# Altium project 平衡车主板.PrjPcb
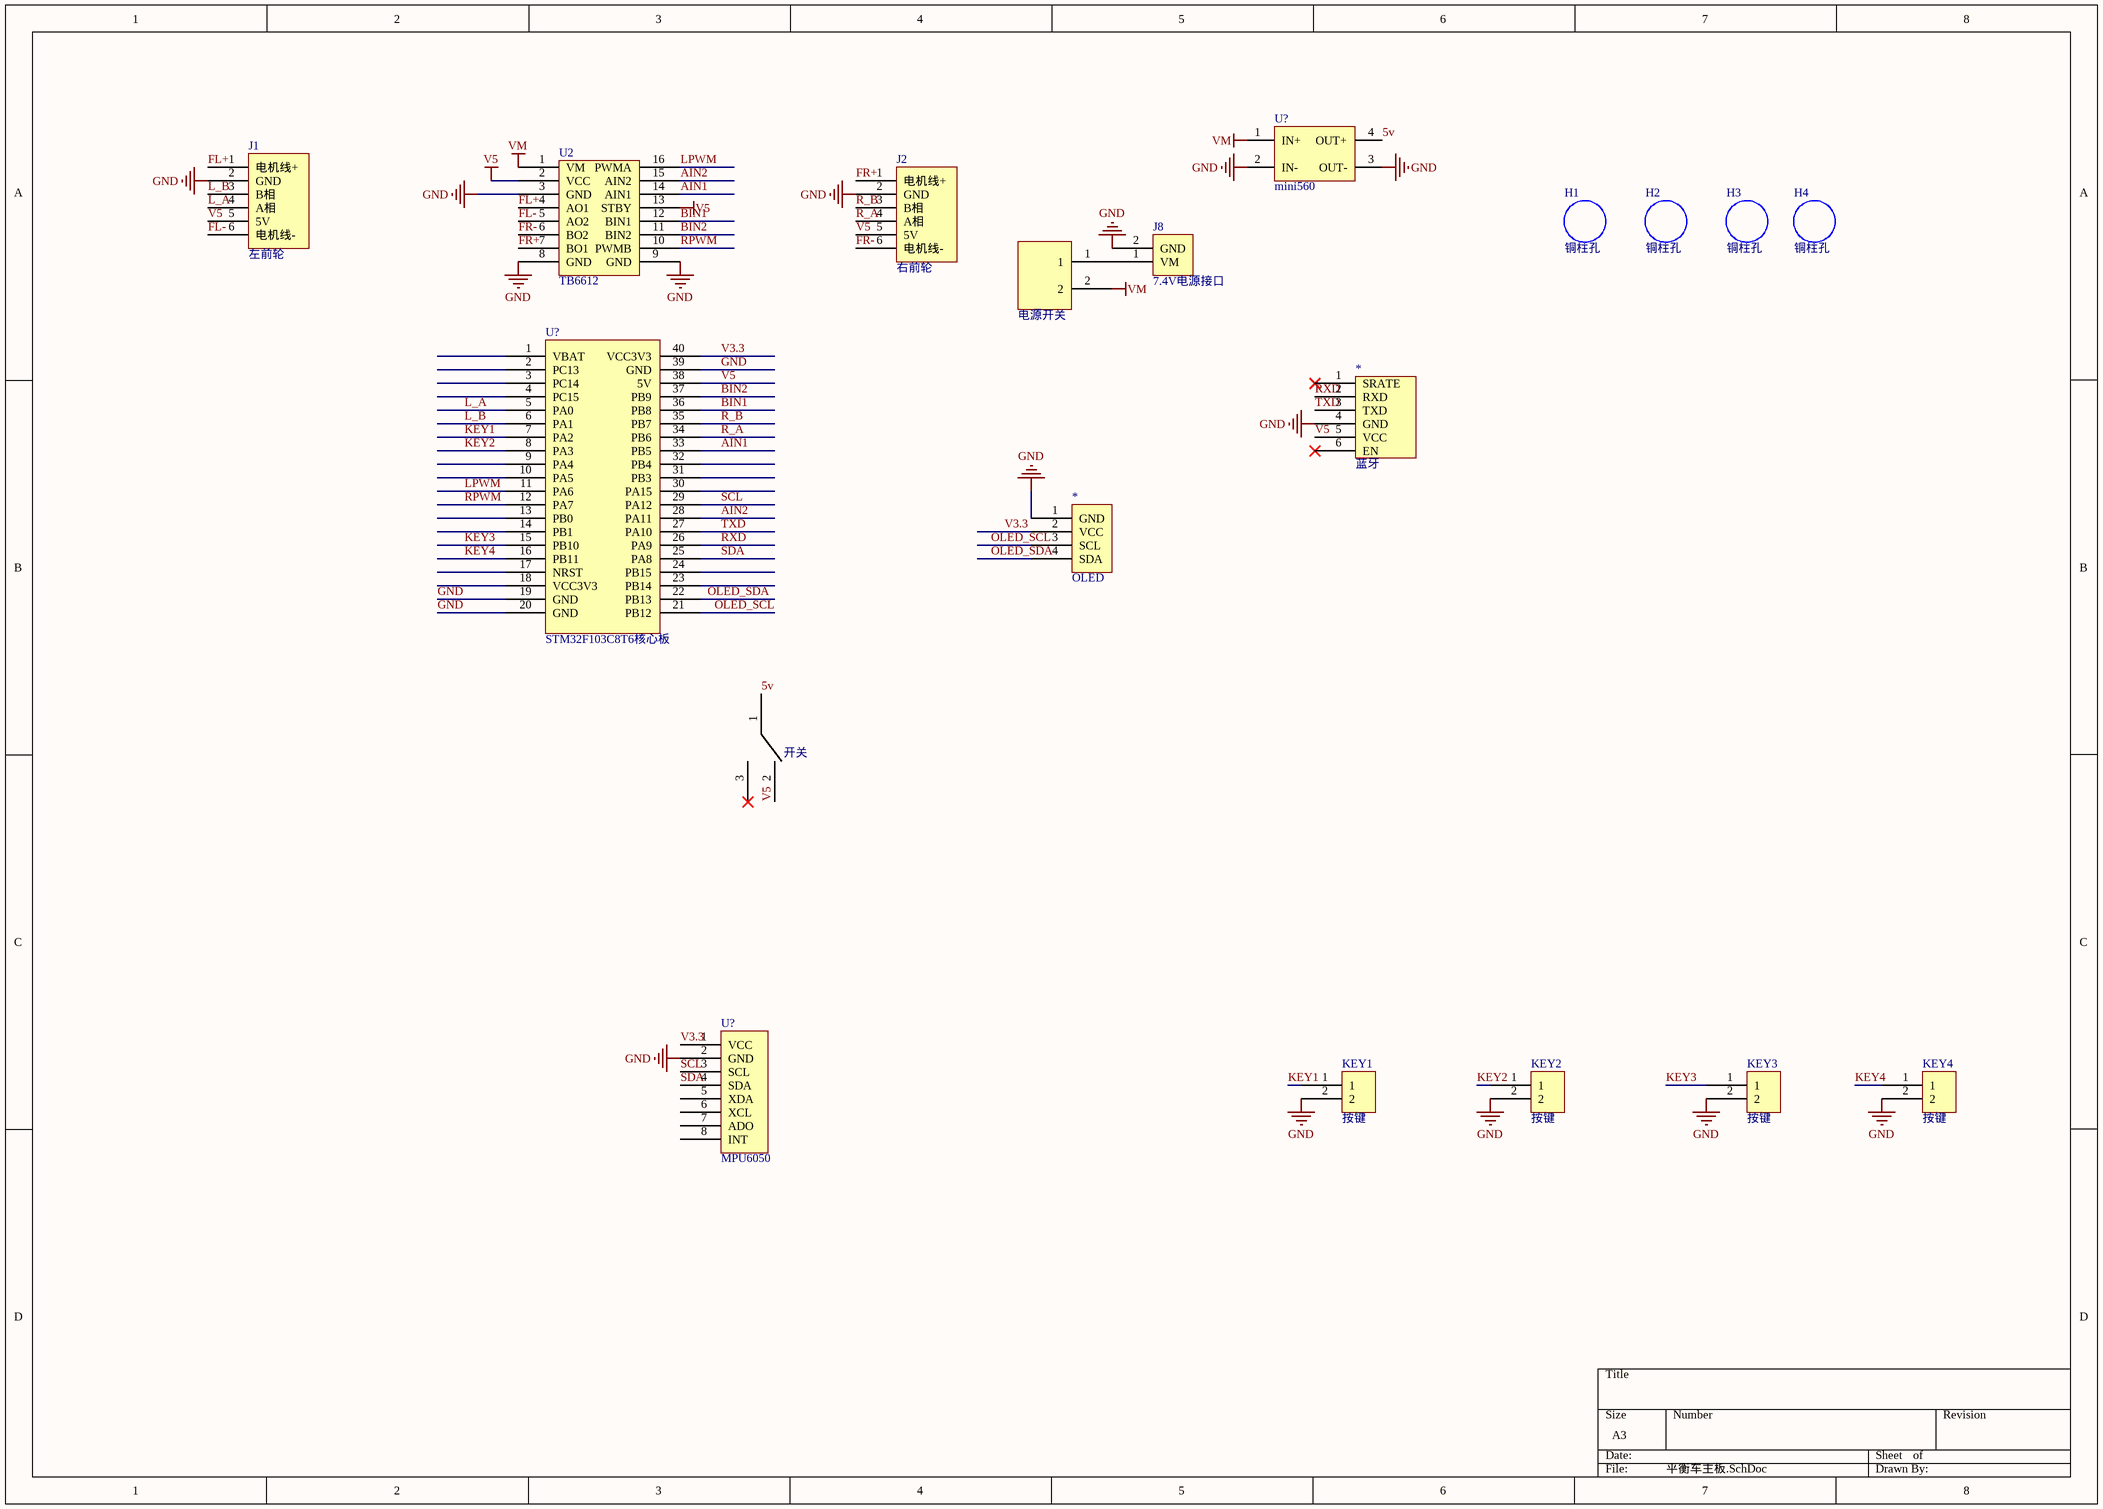
[diagram p0: 平衡车主板.SchDoc]
1 sheet, 19 parts. Net scope: global (net labels, ports and power ports of the same name join across sheets).
Board file: 平衡车主板.PcbDoc

## Sheet 平衡车主板.SchDoc
size A3

### Parts
(Parts that share a designator on the sheet are numbered #1, #2 ... from top to bottom, then left to right.)
*#1  电源开关  [MTS-10x]
*#2  蓝牙  [HDR2.54-M-LI-6P]
*#3  OLED  [HDR2.54-M-LI-4P]
H1  铜柱孔  [M3x10_L]
H2  铜柱孔  [M3x10_L]
H3  铜柱孔  [M3x10_L]
H4  铜柱孔  [M3x10_L]
J1  左前轮  [XH2.54-WI-6P]
J2  右前轮  [XH2.54-WI-6P]
J8  7.4V电源接口  [TX60PW-M20]
KEY1  按键  [TSW SMD-3*6*2.5]
KEY2  按键  [TSW SMD-3*6*2.5]
KEY3  按键  [TSW SMD-3*6*2.5]
KEY4  按键  [TSW SMD-3*6*2.5]
SK1  开关  [LQ_SW_MSS22D18]
U2  TB6612  [TB6612]
U?#1  mini560  [mini560]
U?#2  STM32F103C8T6核心板  [STM32核心板]
U?#3  MPU6050  [MPU6050]

### Nets
GND: *#2.4(GND) *#3.1(GND) J1.2(GND) J2.2(GND) J8.2(GND) KEY1.2 KEY2.2 KEY3.2 KEY4.2 U2.3(GND) U2.8(GND) U2.9(GND) U?#1.2(IN-) U?#1.3(OUT-) U?#2.19(GND) U?#2.20(GND) U?#2.39(GND) U?#3.2(GND)
V5: *#2.5(VCC) J1.5(5V) J2.5(5V) SK1.2 U2.2(VCC) U2.13(STBY) U?#2.38(5V)
VM: *#1.2 U2.1(VM) U?#1.1(IN+)
5v: SK1.1 U?#1.4(OUT+)
AIN1: U2.14(AIN1) U?#2.33(PB5)
AIN2: U2.15(AIN2) U?#2.28(PA11)
BIN1: U2.12(BIN1) U?#2.36(PB8)
BIN2: U2.11(BIN2) U?#2.37(PB9)
FL+: J1.1(电机线+) U2.4(AO1)
FL-: J1.6(电机线-) U2.5(AO2)
FR+: J2.1(电机线+) U2.7(BO1)
FR-: J2.6(电机线-) U2.6(BO2)
KEY1: KEY1.1 U?#2.7(PA2)
KEY2: KEY2.1 U?#2.8(PA3)
KEY3: KEY3.1 U?#2.15(PB10)
KEY4: KEY4.1 U?#2.16(PB11)
L_A: J1.4(A相) U?#2.5(PA0)
L_B: J1.3(B相) U?#2.6(PA1)
LPWM: U2.16(PWMA) U?#2.11(PA6)
OLED_SCL: *#3.3(SCL) U?#2.21(PB12)
OLED_SDA: *#3.4(SDA) U?#2.22(PB13)
R_A: J2.4(A相) U?#2.34(PB6)
R_B: J2.3(B相) U?#2.35(PB7)
RPWM: U2.10(PWMB) U?#2.12(PA7)
RXD: *#2.2(RXD) U?#2.26(PA9)
SCL: U?#2.29(PA12) U?#3.3(SCL)
SDA: U?#2.25(PA8) U?#3.4(SDA)
TXD: *#2.3(TXD) U?#2.27(PA10)
V3.3: *#3.2(VCC) U?#2.40(VCC3V3) U?#3.1(VCC)
Net*#1_1: *#1.1 J8.1(VM)

Not connected (* = marked no-connect by the designer): *#2 1(SRATE)* 6(EN)*; SK1 3*; U?#2 1(VBAT) 2(PC13) 3(PC14) 4(PC15) 9(PA4) 10(PA5) 13(PB0) 14(PB1) 17(NRST) 18(VCC3V3) 23(PB14) 24(PB15) 30(PA15) 31(PB3) 32(PB4); U?#3 5(XDA) 6(XCL) 7(ADO) 8(INT)

### Library data of the parts
J1 J2 = 编码器
U?#1 = mini560: DC-DC稳压模块